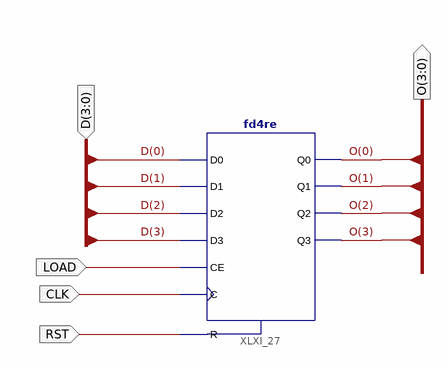
[diagram p0: schematic sheet 1]
// Xilinx ISE schematic my_register_4bit.sch (virtex6) as structural Verilog: 1 symbols, 5 ports
module my_register_4bit (
  input  CLK,
  input  RST,
  input  LOAD,
  input  [3:0] D,
  output [3:0] O
);

  fd4re XLXI_27 (
    .C(CLK), .CE(LOAD), .D0(D[0]), .D1(D[1]), .D2(D[2]), .D3(D[3]), .R(RST), .Q0(O[0]), .Q1(O[1]), .Q2(O[2]),
    .Q3(O[3]));
endmodule
